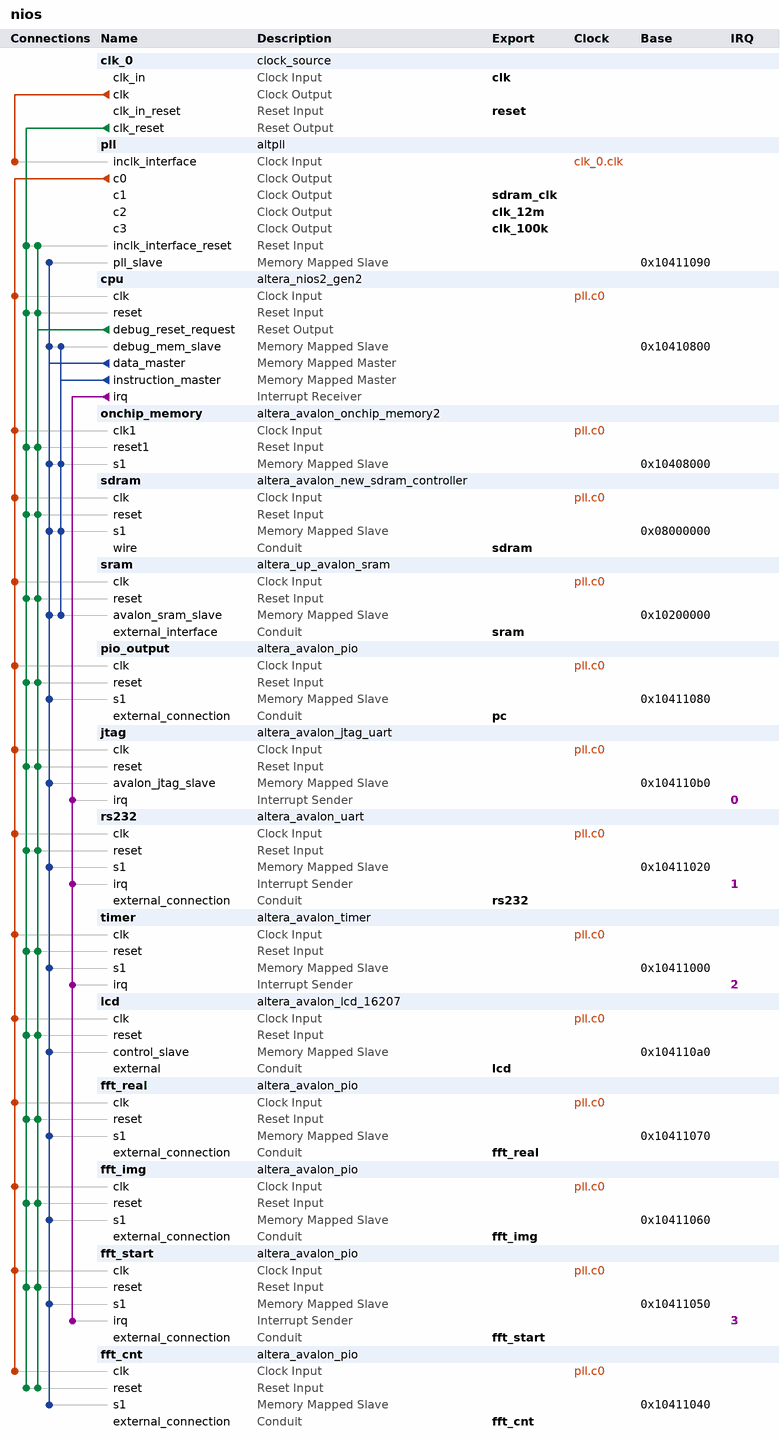
[diagram p0: system contents]
# Platform Designer (Qsys) system nios, Cyclone IV E EP4CE115F29C7
# Parameters at their usual value, and those the tool derives, are not listed.
package require -exact qsys 15.1
create_system nios
set_project_property DEVICE_FAMILY {Cyclone IV E}
set_project_property DEVICE EP4CE115F29C7

add_instance clk_0 clock_source 15.1
set_instance_parameter_value clk_0 clockFrequency 50000000

add_instance pll altpll 15.1
set_instance_parameter_value pll CLK0_DIVIDE_BY 1
set_instance_parameter_value pll CLK0_MULTIPLY_BY 1
set_instance_parameter_value pll CLK1_DIVIDE_BY 1
set_instance_parameter_value pll CLK1_DUTY_CYCLE 50
set_instance_parameter_value pll CLK1_MULTIPLY_BY 1
set_instance_parameter_value pll CLK1_PHASE_SHIFT -3000
set_instance_parameter_value pll CLK2_DIVIDE_BY 25
set_instance_parameter_value pll CLK2_DUTY_CYCLE 50
set_instance_parameter_value pll CLK2_MULTIPLY_BY 6
set_instance_parameter_value pll CLK2_PHASE_SHIFT 0
set_instance_parameter_value pll CLK3_DIVIDE_BY 500
set_instance_parameter_value pll CLK3_DUTY_CYCLE 50
set_instance_parameter_value pll CLK3_MULTIPLY_BY 1
set_instance_parameter_value pll CLK3_PHASE_SHIFT 0
set_instance_parameter_value pll INCLK0_INPUT_FREQUENCY 20000
set_instance_parameter_value pll PORT_ARESET PORT_USED
set_instance_parameter_value pll PORT_LOCKED PORT_USED
set_instance_parameter_value pll PORT_clk1 PORT_USED
set_instance_parameter_value pll PORT_clk2 PORT_USED
set_instance_parameter_value pll PORT_clk3 PORT_USED

add_instance cpu altera_nios2_gen2 15.1
set_instance_parameter_value cpu dcache_size 2048
set_instance_parameter_value cpu exceptionSlave onchip_memory.s1
set_instance_parameter_value cpu icache_size 4096
set_instance_parameter_value cpu impl Fast
set_instance_parameter_value cpu resetSlave onchip_memory.s1

add_instance onchip_memory altera_avalon_onchip_memory2 15.1
set_instance_parameter_value onchip_memory dataWidth 32
set_instance_parameter_value onchip_memory dualPort false
set_instance_parameter_value onchip_memory initMemContent true
set_instance_parameter_value onchip_memory initializationFileName onchip_mem.hex
set_instance_parameter_value onchip_memory memorySize 20480

add_instance sdram altera_avalon_new_sdram_controller 15.1
set_instance_parameter_value sdram TAC 5.5
set_instance_parameter_value sdram TRCD 20.0
set_instance_parameter_value sdram TRP 20.0
set_instance_parameter_value sdram casLatency 3
set_instance_parameter_value sdram columnWidth 10
set_instance_parameter_value sdram dataWidth 32
set_instance_parameter_value sdram generateSimulationModel false
set_instance_parameter_value sdram model single_Micron_MT48LC4M32B2_7_chip
set_instance_parameter_value sdram numberOfBanks 4
set_instance_parameter_value sdram numberOfChipSelects 1
set_instance_parameter_value sdram powerUpDelay 100.0
set_instance_parameter_value sdram refreshPeriod 15.625
set_instance_parameter_value sdram rowWidth 13

add_instance sram altera_up_avalon_sram 15.1
set_instance_parameter_value sram board DE2-115
set_instance_parameter_value sram pixel_buffer false

add_instance pio_output altera_avalon_pio 15.1
set_instance_parameter_value pio_output direction Output
set_instance_parameter_value pio_output width 32

add_instance jtag altera_avalon_jtag_uart 15.1
set_instance_parameter_value jtag simInteractiveOptions NO_INTERACTIVE_WINDOWS

add_instance rs232 altera_avalon_uart 15.1
set_instance_parameter_value rs232 baud 115200
set_instance_parameter_value rs232 dataBits 8
set_instance_parameter_value rs232 fixedBaud true
set_instance_parameter_value rs232 parity NONE
set_instance_parameter_value rs232 stopBits 1
set_instance_parameter_value rs232 useCtsRts true

add_instance timer altera_avalon_timer 15.1
set_instance_parameter_value timer period 1
set_instance_parameter_value timer periodUnits MSEC

add_instance lcd altera_avalon_lcd_16207 15.1

add_instance fft_real altera_avalon_pio 15.1
set_instance_parameter_value fft_real direction Input
set_instance_parameter_value fft_real width 24

add_instance fft_img altera_avalon_pio 15.1
set_instance_parameter_value fft_img direction Input
set_instance_parameter_value fft_img width 24

add_instance fft_start altera_avalon_pio 15.1
set_instance_parameter_value fft_start bitClearingEdgeCapReg true
set_instance_parameter_value fft_start captureEdge true
set_instance_parameter_value fft_start direction Input
set_instance_parameter_value fft_start generateIRQ true
set_instance_parameter_value fft_start irqType EDGE
set_instance_parameter_value fft_start width 1

add_instance fft_cnt altera_avalon_pio 15.1
set_instance_parameter_value fft_cnt direction Input
set_instance_parameter_value fft_cnt width 10

# connections
add_connection clk_0.clk pll.inclk_interface clock
add_connection pll.c0 cpu.clk clock
add_connection pll.c0 fft_cnt.clk clock
add_connection pll.c0 fft_img.clk clock
add_connection pll.c0 fft_real.clk clock
add_connection pll.c0 fft_start.clk clock
add_connection pll.c0 jtag.clk clock
add_connection pll.c0 lcd.clk clock
add_connection pll.c0 onchip_memory.clk1 clock
add_connection pll.c0 pio_output.clk clock
add_connection pll.c0 rs232.clk clock
add_connection pll.c0 sdram.clk clock
add_connection pll.c0 sram.clk clock
add_connection pll.c0 timer.clk clock
add_connection clk_0.clk_reset cpu.reset reset
add_connection clk_0.clk_reset fft_cnt.reset reset
add_connection clk_0.clk_reset fft_img.reset reset
add_connection clk_0.clk_reset fft_real.reset reset
add_connection clk_0.clk_reset fft_start.reset reset
add_connection clk_0.clk_reset jtag.reset reset
add_connection clk_0.clk_reset lcd.reset reset
add_connection clk_0.clk_reset onchip_memory.reset1 reset
add_connection clk_0.clk_reset pio_output.reset reset
add_connection clk_0.clk_reset pll.inclk_interface_reset reset
add_connection clk_0.clk_reset rs232.reset reset
add_connection clk_0.clk_reset sdram.reset reset
add_connection clk_0.clk_reset sram.reset reset
add_connection clk_0.clk_reset timer.reset reset
add_connection cpu.debug_reset_request cpu.reset reset
add_connection cpu.debug_reset_request fft_cnt.reset reset
add_connection cpu.debug_reset_request fft_img.reset reset
add_connection cpu.debug_reset_request fft_real.reset reset
add_connection cpu.debug_reset_request fft_start.reset reset
add_connection cpu.debug_reset_request jtag.reset reset
add_connection cpu.debug_reset_request lcd.reset reset
add_connection cpu.debug_reset_request onchip_memory.reset1 reset
add_connection cpu.debug_reset_request pio_output.reset reset
add_connection cpu.debug_reset_request pll.inclk_interface_reset reset
add_connection cpu.debug_reset_request rs232.reset reset
add_connection cpu.debug_reset_request sdram.reset reset
add_connection cpu.debug_reset_request sram.reset reset
add_connection cpu.debug_reset_request timer.reset reset
add_connection cpu.data_master cpu.debug_mem_slave avalon
set_connection_parameter_value cpu.data_master/cpu.debug_mem_slave baseAddress 0x10410800
add_connection cpu.data_master fft_cnt.s1 avalon
set_connection_parameter_value cpu.data_master/fft_cnt.s1 baseAddress 0x10411040
add_connection cpu.data_master fft_img.s1 avalon
set_connection_parameter_value cpu.data_master/fft_img.s1 baseAddress 0x10411060
add_connection cpu.data_master fft_real.s1 avalon
set_connection_parameter_value cpu.data_master/fft_real.s1 baseAddress 0x10411070
add_connection cpu.data_master fft_start.s1 avalon
set_connection_parameter_value cpu.data_master/fft_start.s1 baseAddress 0x10411050
add_connection cpu.data_master jtag.avalon_jtag_slave avalon
set_connection_parameter_value cpu.data_master/jtag.avalon_jtag_slave baseAddress 0x104110b0
add_connection cpu.data_master lcd.control_slave avalon
set_connection_parameter_value cpu.data_master/lcd.control_slave baseAddress 0x104110a0
add_connection cpu.data_master onchip_memory.s1 avalon
set_connection_parameter_value cpu.data_master/onchip_memory.s1 baseAddress 0x10408000
add_connection cpu.data_master pio_output.s1 avalon
set_connection_parameter_value cpu.data_master/pio_output.s1 baseAddress 0x10411080
add_connection cpu.data_master pll.pll_slave avalon
set_connection_parameter_value cpu.data_master/pll.pll_slave baseAddress 0x10411090
add_connection cpu.data_master rs232.s1 avalon
set_connection_parameter_value cpu.data_master/rs232.s1 baseAddress 0x10411020
add_connection cpu.data_master sdram.s1 avalon
set_connection_parameter_value cpu.data_master/sdram.s1 baseAddress 0x08000000
add_connection cpu.data_master sram.avalon_sram_slave avalon
set_connection_parameter_value cpu.data_master/sram.avalon_sram_slave baseAddress 0x10200000
add_connection cpu.data_master timer.s1 avalon
set_connection_parameter_value cpu.data_master/timer.s1 baseAddress 0x10411000
add_connection cpu.instruction_master cpu.debug_mem_slave avalon
set_connection_parameter_value cpu.instruction_master/cpu.debug_mem_slave baseAddress 0x10410800
add_connection cpu.instruction_master onchip_memory.s1 avalon
set_connection_parameter_value cpu.instruction_master/onchip_memory.s1 baseAddress 0x10408000
add_connection cpu.instruction_master sdram.s1 avalon
set_connection_parameter_value cpu.instruction_master/sdram.s1 baseAddress 0x08000000
add_connection cpu.instruction_master sram.avalon_sram_slave avalon
set_connection_parameter_value cpu.instruction_master/sram.avalon_sram_slave baseAddress 0x10200000
add_connection cpu.irq fft_start.irq interrupt
set_connection_parameter_value cpu.irq/fft_start.irq irqNumber 3
add_connection cpu.irq jtag.irq interrupt
set_connection_parameter_value cpu.irq/jtag.irq irqNumber 0
add_connection cpu.irq rs232.irq interrupt
set_connection_parameter_value cpu.irq/rs232.irq irqNumber 1
add_connection cpu.irq timer.irq interrupt
set_connection_parameter_value cpu.irq/timer.irq irqNumber 2

# exported interfaces
add_interface clk clock sink
set_interface_property clk EXPORT_OF clk_0.clk_in
add_interface clk_100k clock source
set_interface_property clk_100k EXPORT_OF pll.c3
add_interface clk_12m clock source
set_interface_property clk_12m EXPORT_OF pll.c2
add_interface fft_cnt conduit end
set_interface_property fft_cnt EXPORT_OF fft_cnt.external_connection
add_interface fft_img conduit end
set_interface_property fft_img EXPORT_OF fft_img.external_connection
add_interface fft_real conduit end
set_interface_property fft_real EXPORT_OF fft_real.external_connection
add_interface fft_start conduit end
set_interface_property fft_start EXPORT_OF fft_start.external_connection
add_interface lcd conduit end
set_interface_property lcd EXPORT_OF lcd.external
add_interface pc conduit end
set_interface_property pc EXPORT_OF pio_output.external_connection
add_interface reset reset sink
set_interface_property reset EXPORT_OF clk_0.clk_in_reset
add_interface rs232 conduit end
set_interface_property rs232 EXPORT_OF rs232.external_connection
add_interface sdram conduit end
set_interface_property sdram EXPORT_OF sdram.wire
add_interface sdram_clk clock source
set_interface_property sdram_clk EXPORT_OF pll.c1
add_interface sram conduit end
set_interface_property sram EXPORT_OF sram.external_interface

set_interconnect_requirement {$system} qsys_mm.clockCrossingAdapter HANDSHAKE
set_interconnect_requirement {$system} qsys_mm.enableEccProtection FALSE
set_interconnect_requirement {$system} qsys_mm.insertDefaultSlave FALSE
set_interconnect_requirement {$system} qsys_mm.maxAdditionalLatency 1

save_system nios.qsys
